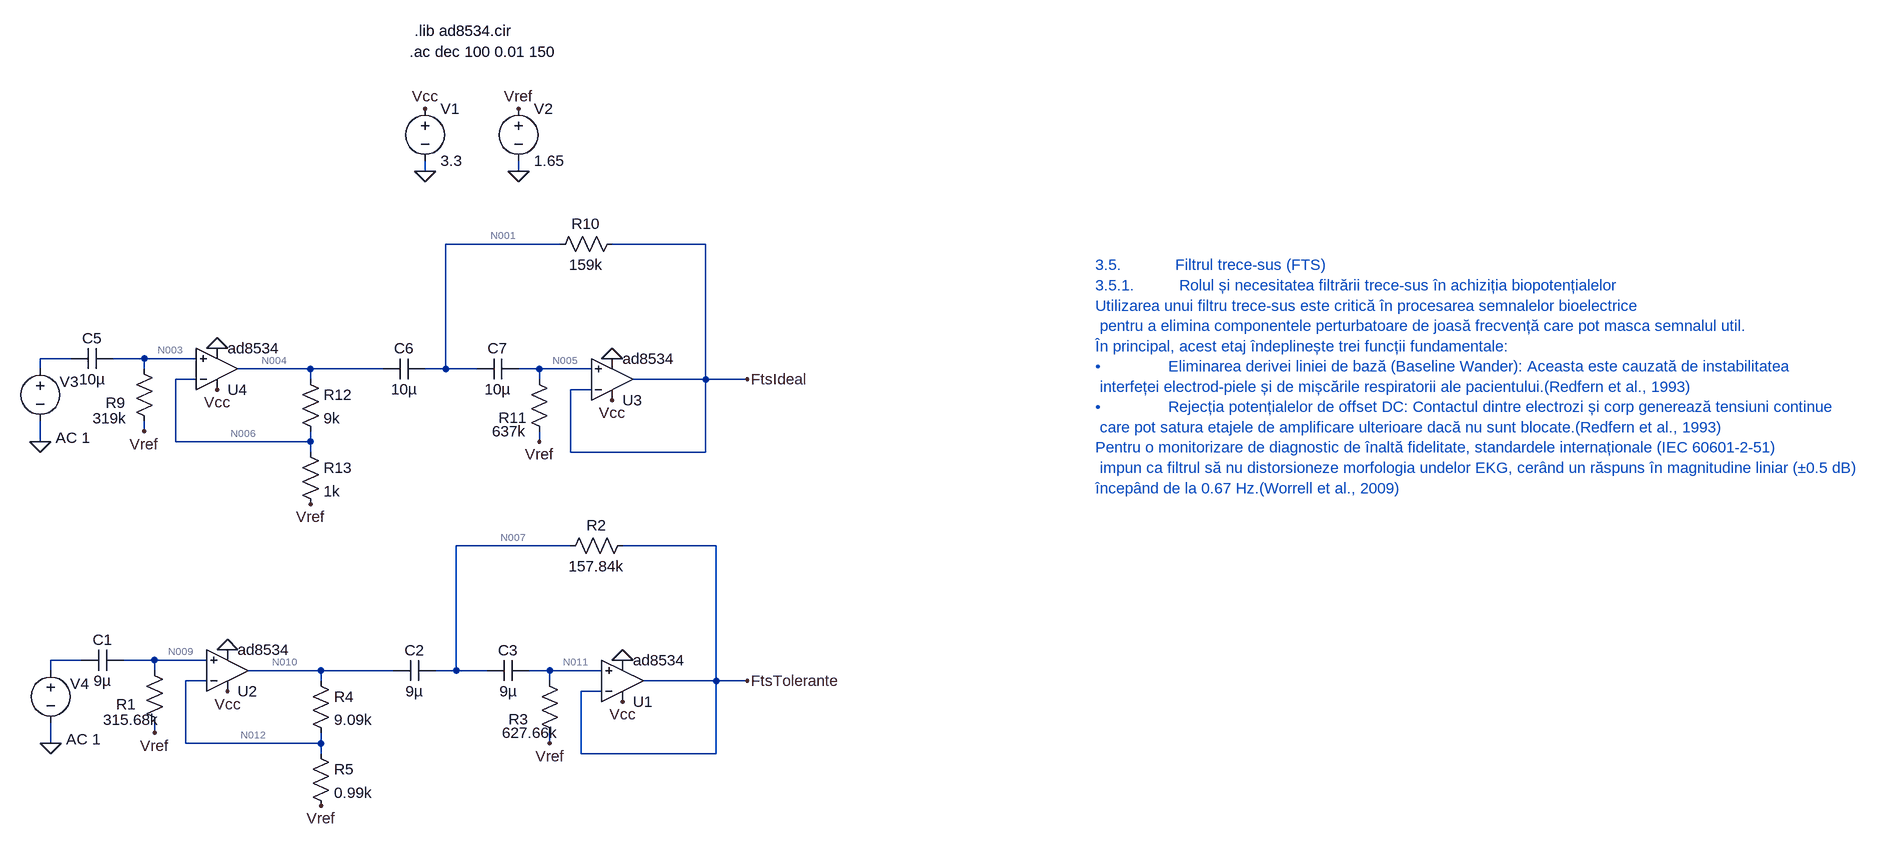
[diagram p0: schematic FTS.asc]
FTS.asc, the LTspice schematic file:
Version 4.1
SHEET 1 2344 960
WIRE 176 -192 176 -208
WIRE 320 -192 320 -208
WIRE 384 -80 208 -80
WIRE 608 -80 464 -80
WIRE -368 96 -416 96
WIRE -256 96 -304 96
WIRE -176 96 -256 96
WIRE -416 112 -416 96
WIRE -256 112 -256 96
WIRE 0 112 -112 112
WIRE 112 112 0 112
WIRE 208 112 208 -80
WIRE 208 112 176 112
WIRE 256 112 208 112
WIRE 352 112 320 112
WIRE 432 112 352 112
WIRE -176 128 -208 128
WIRE 0 128 0 112
WIRE 352 128 352 112
WIRE 608 128 608 -80
WIRE 608 128 496 128
WIRE 672 128 608 128
WIRE 432 144 400 144
WIRE -256 208 -256 192
WIRE -416 224 -416 192
WIRE -208 224 -208 128
WIRE 0 224 0 208
WIRE 0 224 -208 224
WIRE 352 224 352 208
WIRE 0 240 0 224
WIRE 400 240 400 144
WIRE 608 240 608 128
WIRE 608 240 400 240
WIRE 400 384 224 384
WIRE 624 384 480 384
WIRE -352 560 -400 560
WIRE -240 560 -288 560
WIRE -160 560 -240 560
WIRE -400 576 -400 560
WIRE -240 576 -240 560
WIRE 16 576 -96 576
WIRE 128 576 16 576
WIRE 224 576 224 384
WIRE 224 576 192 576
WIRE 272 576 224 576
WIRE 368 576 336 576
WIRE 448 576 368 576
WIRE -160 592 -192 592
WIRE 16 592 16 576
WIRE 368 592 368 576
WIRE 624 592 624 384
WIRE 624 592 512 592
WIRE 672 592 624 592
WIRE 448 608 416 608
WIRE -240 672 -240 656
WIRE -400 688 -400 656
WIRE -192 688 -192 592
WIRE 16 688 16 672
WIRE 16 688 -192 688
WIRE 368 688 368 672
WIRE 16 704 16 688
WIRE 416 704 416 608
WIRE 624 704 624 592
WIRE 624 704 416 704
FLAG 176 -192 0
FLAG 176 -288 Vcc
FLAG 320 -192 0
FLAG 320 -288 Vref
FLAG 352 224 Vref
FLAG 464 96 0
FLAG 464 160 Vcc
FLAG -256 208 Vref
FLAG -144 80 0
FLAG -144 144 Vcc
FLAG 0 320 Vref
FLAG -416 224 0
FLAG 368 688 Vref
FLAG 480 560 0
FLAG 480 624 Vcc
FLAG -240 672 Vref
FLAG -128 544 0
FLAG -128 608 Vcc
FLAG 16 784 Vref
FLAG -400 688 0
FLAG 672 128 FtsIdeal
FLAG 672 592 FtsTolerante
SYMBOL voltage 176 -304 R0
SYMATTR InstName V1
SYMATTR Value 3.3
SYMBOL voltage 320 -304 R0
SYMATTR InstName V2
SYMATTR Value 1.65
SYMBOL OpAmps\\opamp2 464 192 M180
SYMATTR InstName U3
SYMATTR Value ad8534
SYMBOL OpAmps\\opamp2 -144 176 M180
SYMATTR InstName U4
SYMATTR Value ad8534
SYMBOL cap -304 80 R90
WINDOW 0 0 32 VBottom 2
WINDOW 3 32 32 VTop 2
SYMATTR InstName C5
SYMATTR Value 10µ
SYMBOL res -272 96 R0
WINDOW 0 -43 68 Left 2
WINDOW 3 -63 92 Left 2
SYMATTR InstName R9
SYMATTR Value 319k
SYMBOL cap 176 96 R90
WINDOW 0 0 32 VBottom 2
WINDOW 3 32 32 VTop 2
SYMATTR InstName C6
SYMATTR Value 10µ
SYMBOL cap 320 96 R90
WINDOW 0 0 32 VBottom 2
WINDOW 3 32 32 VTop 2
SYMATTR InstName C7
SYMATTR Value 10µ
SYMBOL res 480 -96 R90
WINDOW 0 0 56 VBottom 2
WINDOW 3 32 56 VTop 2
SYMATTR InstName R10
SYMATTR Value 159k
SYMBOL res 336 112 R0
WINDOW 0 -47 75 Left 2
WINDOW 3 -57 96 Left 2
SYMATTR InstName R11
SYMATTR Value 637k
SYMBOL res -16 112 R0
SYMATTR InstName R12
SYMATTR Value 9k
SYMBOL res -16 224 R0
SYMATTR InstName R13
SYMATTR Value 1k
SYMBOL voltage -416 96 R0
WINDOW 0 30 36 Left 2
WINDOW 123 24 122 Left 2
WINDOW 39 0 0 Left 0
SYMATTR InstName V3
SYMATTR Value ""
SYMATTR Value2 AC 1
SYMBOL OpAmps\\opamp2 480 656 M180
SYMATTR InstName U1
SYMATTR Value ad8534
SYMBOL OpAmps\\opamp2 -128 640 M180
SYMATTR InstName U2
SYMATTR Value ad8534
SYMBOL cap -288 544 R90
WINDOW 0 0 32 VBottom 2
WINDOW 3 32 32 VTop 2
SYMATTR InstName C1
SYMATTR Value 9µ
SYMBOL res -256 560 R0
WINDOW 0 -43 68 Left 2
WINDOW 3 -63 92 Left 2
SYMATTR InstName R1
SYMATTR Value 315.68k
SYMBOL cap 192 560 R90
WINDOW 0 0 32 VBottom 2
WINDOW 3 32 32 VTop 2
SYMATTR InstName C2
SYMATTR Value 9µ
SYMBOL cap 336 560 R90
WINDOW 0 0 32 VBottom 2
WINDOW 3 32 32 VTop 2
SYMATTR InstName C3
SYMATTR Value 9µ
SYMBOL res 496 368 R90
WINDOW 0 0 56 VBottom 2
WINDOW 3 32 56 VTop 2
SYMATTR InstName R2
SYMATTR Value 157.84k
SYMBOL res 352 576 R0
WINDOW 0 -47 75 Left 2
WINDOW 3 -57 96 Left 2
SYMATTR InstName R3
SYMATTR Value 627.66k
SYMBOL res 0 576 R0
SYMATTR InstName R4
SYMATTR Value 9.09k
SYMBOL res 0 688 R0
SYMATTR InstName R5
SYMATTR Value 0.99k
SYMBOL voltage -400 560 R0
WINDOW 0 30 36 Left 2
WINDOW 123 24 122 Left 2
WINDOW 39 0 0 Left 0
SYMATTR InstName V4
SYMATTR Value ""
SYMATTR Value2 AC 1
TEXT 152 -376 Left 2 !.ac dec 100 0.01 150
TEXT 160 -408 Left 2 !.lib ad8534.cir
TEXT 1208 -48 Left 2 ;3.5.            Filtrul trece-sus (FTS)\n3.5.1.          Rolul și necesitatea filtrării trece-sus în achiziția biopotențialelor\nUtilizarea unui filtru trece-sus este critică în procesarea semnalelor bioelectrice\n pentru a elimina componentele perturbatoare de joasă frecvență care pot masca semnalul util. \nÎn principal, acest etaj îndeplinește trei funcții fundamentale:\n•               Eliminarea derivei liniei de bază (Baseline Wander): Aceasta este cauzată de instabilitatea\n interfeței electrod-piele și de mișcările respiratorii ale pacientului.(Redfern et al., 1993)\n•               Rejecția potențialelor de offset DC: Contactul dintre electrozi și corp generează tensiuni continue\n care pot satura etajele de amplificare ulterioare dacă nu sunt blocate.(Redfern et al., 1993)\nPentru o monitorizare de diagnostic de înaltă fidelitate, standardele internaționale (IEC 60601-2-51)\n impun ca filtrul să nu distorsioneze morfologia undelor EKG, cerând un răspuns în magnitudine liniar (±0.5 dB) \nîncepând de la 0.67 Hz.(Worrell et al., 2009)

The netlist it stands for:
* FTS.asc
V1 Vcc 0 3.3
V2 Vref 0 1.65
X§U3 N005 FtsIdeal Vcc 0 FtsIdeal ad8534  ; pins In+ In- V+ V- OUT
X§U4 N003 N006 Vcc 0 N004 ad8534  ; pins In+ In- V+ V- OUT
C5 N003 N002 10µ
R9 N003 Vref 319k
C6 N001 N004 10µ
C7 N005 N001 10µ
R10 FtsIdeal N001 159k
R11 N005 Vref 637k
R12 N004 N006 9k
R13 N006 Vref 1k
V3 N002 0 AC 1
X§U1 N011 FtsTolerante Vcc 0 FtsTolerante ad8534  ; pins In+ In- V+ V- OUT
X§U2 N009 N012 Vcc 0 N010 ad8534  ; pins In+ In- V+ V- OUT
C1 N009 N008 9µ
R1 N009 Vref 315.68k
C2 N007 N010 9µ
C3 N011 N007 9µ
R2 FtsTolerante N007 157.84k
R3 N011 Vref 627.66k
R4 N010 N012 9.09k
R5 N012 Vref 0.99k
V4 N008 0 AC 1
.ac dec 100 0.01 150
.lib ad8534.cir
* 3.5.            Filtrul trece-sus (FTS)
* 3.5.1.          Rolul și necesitatea filtrării trece-sus în achiziția biopotențialelor
* Utilizarea unui filtru trece-sus este critică în procesarea semnalelor bioelectrice
*  pentru a elimina componentele perturbatoare de joasă frecvență care pot masca semnalul util.
* În principal, acest etaj îndeplinește trei funcții fundamentale:
* •               Eliminarea derivei liniei de bază (Baseline Wander): Aceasta este cauzată de instabilitatea
*  interfeței electrod-piele și de mișcările respiratorii ale pacientului.(Redfern et al., 1993)
* •               Rejecția potențialelor de offset DC: Contactul dintre electrozi și corp generează tensiuni continue
*  care pot satura etajele de amplificare ulterioare dacă nu sunt blocate.(Redfern et al., 1993)
* Pentru o monitorizare de diagnostic de înaltă fidelitate, standardele internaționale (IEC 60601-2-51)
*  impun ca filtrul să nu distorsioneze morfologia undelor EKG, cerând un răspuns în magnitudine liniar (±0.5 dB)
* începând de la 0.67 Hz.(Worrell et al., 2009)
.backanno
.end

* Results of the author's LTspice run, read from the files saved beside the schematic
* Operating Point, zero values left out:
*   V(ftsideal) = 1.655 V
*   V(ftstolerante) = 1.655 V
*   V(n001) = 1.655 V
*   V(n003) = 1.65 V
*   V(n004) = 1.7 V
*   V(n005) = 1.65 V
*   V(n006) = 1.655 V
*   V(n007) = 1.655 V
*   V(n009) = 1.65 V
*   V(n010) = 1.701 V
*   V(n011) = 1.65 V
*   V(n012) = 1.655 V
*   V(vcc) = 3.3 V
*   V(vref) = 1.65 V
*   I(R1) = -4.5 pA
*   I(R11) = -4.5 pA
*   I(R12) = 5.01 µA
*   I(R13) = 5.01 µA
*   I(R3) = -4.5 pA
*   I(R4) = 5.06 µA
*   I(R5) = 5.06 µA
*   I(R9) = -4.5 pA
*   I(V1) = -2.352 mA
*   I(V2) = 10.07 µA
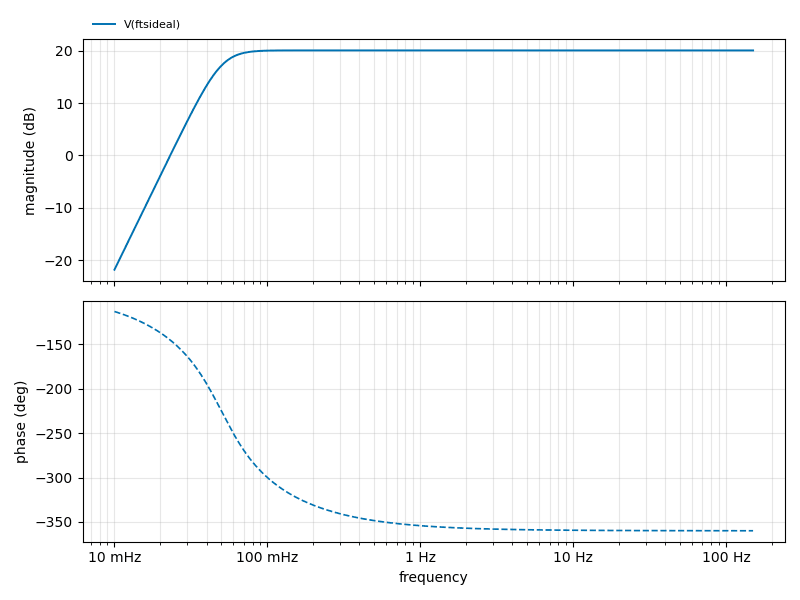
[diagram p1: AC Analysis of FTS.asc, plotted from the saved traces]
* AC Analysis, 1 run:
*   V(ftsideal): -21.84 dB at 10 mHz, 20.08 dB at 150 Hz, peak 20.08 dB at 162.2 mHz, 3 dB below the peak at 49.68 mHz